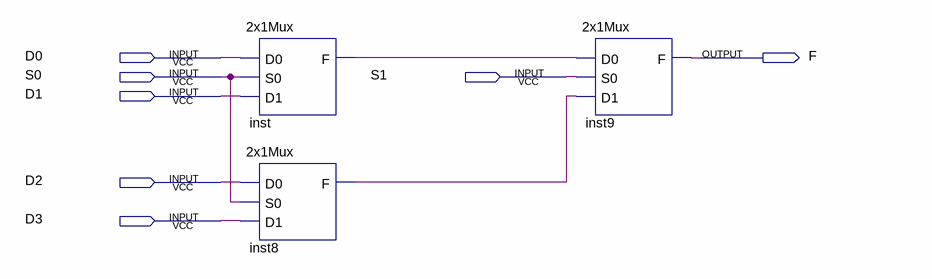
[diagram p0: schematic sheet]
// Quartus schematic 4x1Mux.bdf as structural Verilog: 3 symbols, 7 pins
module \4x1Mux  (
  input  D0,
  input  S0,
  input  S1,
  input  D1,
  input  D2,
  input  D3,
  output F
);

  wire inst8_f, inst_f;

  \2x1Mux  inst (.D0(D0), .S0(S0), .D1(D1), .F(inst_f));
  \2x1Mux  inst8 (.D0(D2), .S0(S0), .D1(D3), .F(inst8_f));
  \2x1Mux  inst9 (.D0(inst_f), .S0(S1), .D1(inst8_f), .F(F));
endmodule
